# Altium schematic sheet 3.3V-Regulator.SchDoc
size A; SheetNumber: 4; SheetTotal: 12
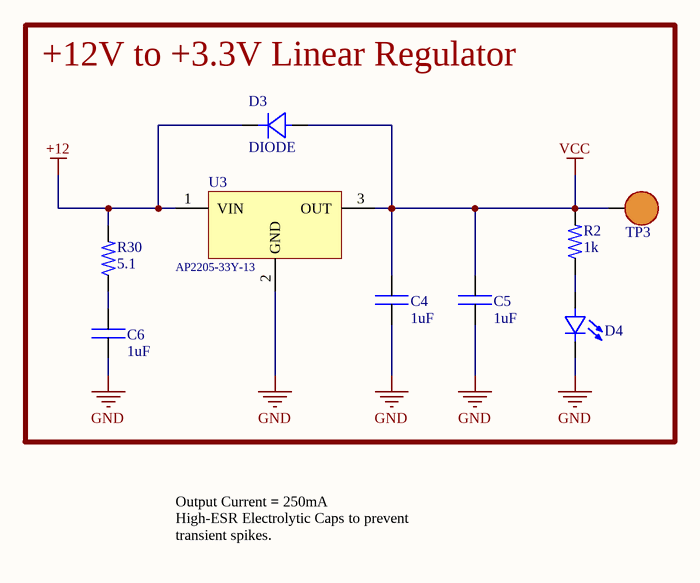
[diagram p0: 3.3V-Regulator.SchDoc]

## Parts
C4  value 1uF  [0402C]  (hidden comment: CAP)
C5  value 1uF  [0402C]  (hidden comment: CAP)
C6  value 1uF  [0402C]  (hidden comment: CAP)
D3  DIODE  [DO-214AC]
D4  LED - single  [LED - 0603]  (value not drawn)
R2  value 1k  [0402R]  (hidden comment: RES)
R30  value 5.1  [0805R]  (hidden comment: RES)
TP3  RCWCTE  [RCWCTE]  (value not drawn)
U3  AP2205-33Y-13  [SOT-89-3]

## Blocks framed on the sheet
+12V to +3.3V Linear Regulator: C4-C6 D3 D4 R2 R30 TP3 U3

## Nets
+12: D3.K R30.2 U3.1(VIN)
GND: C4.1 C5.1 C6.1 D4.2(C) U3.2(GND)
VCC: C4.2 C5.2 D3.A R2.2 TP3.1 U3.3(OUT)
NetC6_2: C6.2 R30.1
NetD4_1: D4.1(A) R2.1

## Notes on the sheet
- Output Current = 250mA
  High-ESR Electrolytic Caps to prevent transient spikes.

## Library data of the parts
C4-C6 = CAP: Capacitor; MFR: Murata Electronics; MFR PN: GRM155R61E105MA12D; Type: SMD; Vendor: *; Vendor PN: *; Vendor Link: *
D3 = DIODE: DIODE GEN PURP; MFR: Micro Commercial Co; MFR PN: GS1M-LTP; Type: SMD; Value: *
D4 = LED - single: LED; MFR: DNS; Type: SMD; Color: *; MFR PN: DNS
R2 = RES: Resistor; MFR PN: RC0402JR-071KL; MFR: YAGEO; Vendor: *; Vendor PN: *; Vendor Link: *; Type: SMD
R30 = RES: Resistor; MFR PN: ESR10EZPJ5R1; MFR: Rohm Semiconductor; Vendor: *; Vendor PN: *; Vendor Link: *; Type: SMD
TP3 = TEST POINT: Test Point, Surface Mount; MFR: KOA Speer Electronics, Inc.; MFR PN: RCWCTE; Type: SMD
U3 = LIN REG 3.3V 250mA 24V: IC REG LINEAR 3.3V 250MA SOT89-3; MFR: Diodes Incorporated; MFR PN: AP2205-33Y-13; Type: SMD